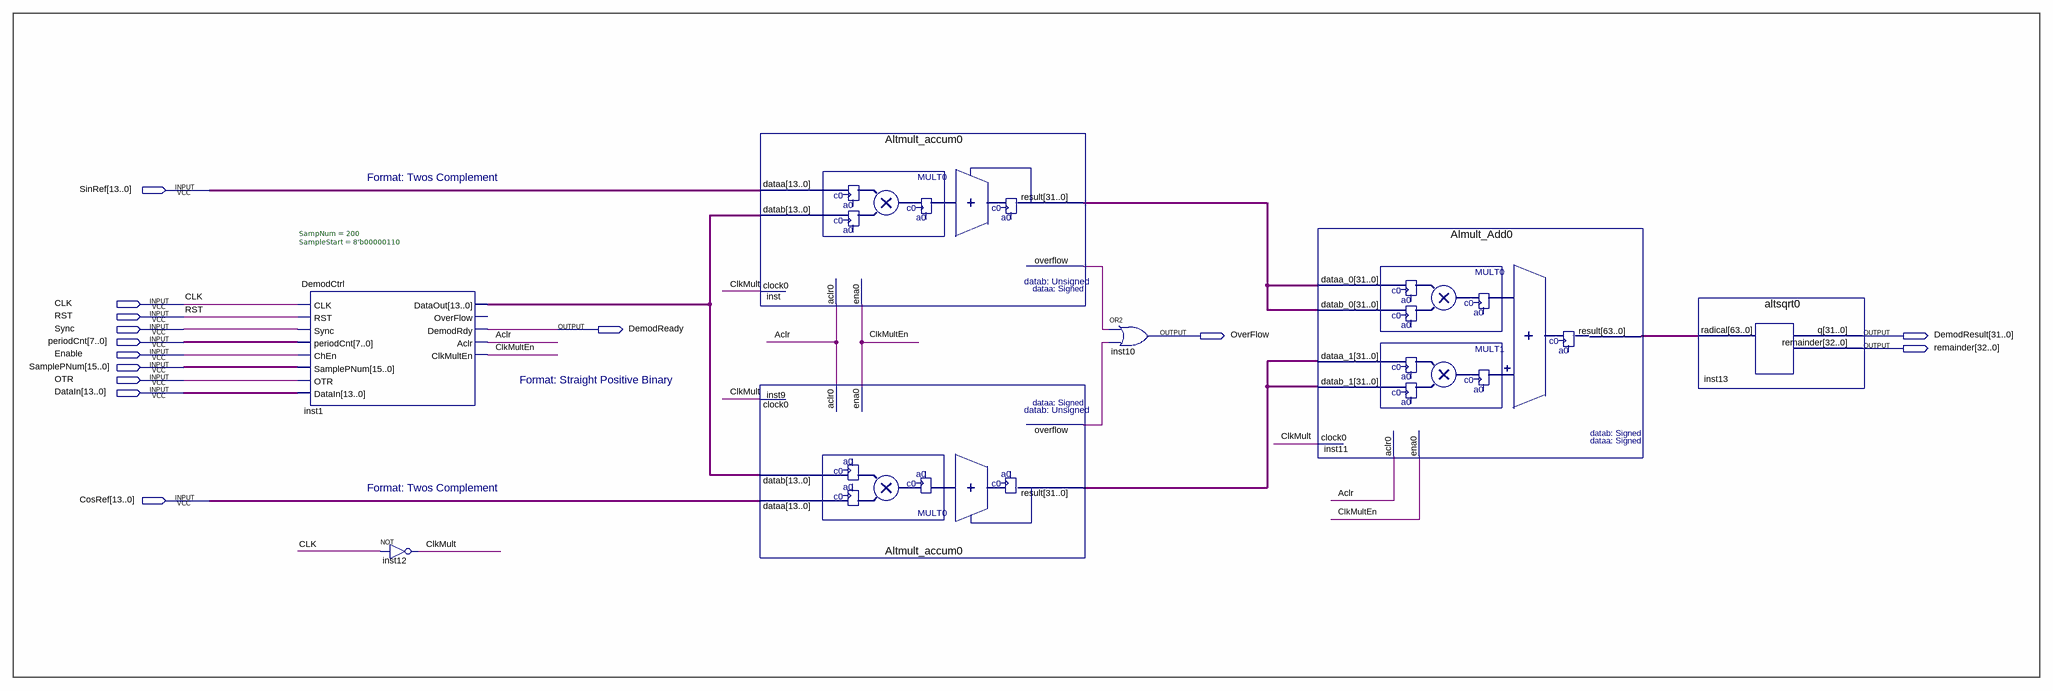
[diagram p0: schematic sheet]
// Quartus schematic DigitalDemodulation.bdf as structural Verilog: 7 symbols, 14 pins
module DigitalDemodulation (
  input  [13:0] SinRef,
  input  CLK,
  input  RST,
  input  Sync,
  input  [7:0] periodCnt,
  input  Enable,
  input  [15:0] SamplePNum,
  input  OTR,
  input  [13:0] DataIn,
  input  [13:0] CosRef,
  output DemodReady,
  output OverFlow,
  output [31:0] DemodResult,
  output [32:0] remainder
);

  wire Aclr, ClkMult, ClkMultEn, inst9_overflow, inst_overflow;
  wire [13:0] inst1_dataout;
  wire [31:0] inst9_result, inst_result;
  wire [63:0] inst11_result;

  DemodCtrl #(.SampNum(200), .SampleStart(8'b00000110)) inst1 (
    .CLK(CLK), .RST(RST), .Sync(Sync), .periodCnt(periodCnt), .ChEn(Enable), .SamplePNum(SamplePNum),
    .OTR(OTR), .DataIn(DataIn), .DataOut(inst1_dataout), .DemodRdy(DemodReady), .Aclr(Aclr),
    .ClkMultEn(ClkMultEn));  // open: OverFlow
  not inst12 (ClkMult, CLK);
  Altmult_accum0 inst (
    .dataa(SinRef), .datab(inst1_dataout), .clock0(ClkMult), .aclr0(Aclr), .ena0(ClkMultEn),
    .result(inst_result), .overflow(inst_overflow));
  Altmult_accum0 inst9 (
    .dataa(CosRef), .datab(inst1_dataout), .clock0(ClkMult), .aclr0(Aclr), .ena0(ClkMultEn),
    .result(inst9_result), .overflow(inst9_overflow));
  or inst10 (OverFlow, inst_overflow, inst9_overflow);
  Almult_Add0 inst11 (
    .dataa_0(inst_result), .datab_0(inst_result), .dataa_1(inst9_result), .datab_1(inst9_result),
    .clock0(ClkMult), .aclr0(Aclr), .ena0(ClkMultEn), .result(inst11_result));
  altsqrt0 inst13 (.radical(inst11_result), .q(DemodResult), .remainder(remainder));

  // Notes on the sheet:
  //   Format: Twos Complement
  //   Format: Straight Positive Binary
  //   Format: Twos Complement
endmodule
